# EAGLE schematic LiPo_Battery_Charger (EAGLE 9.6.2)
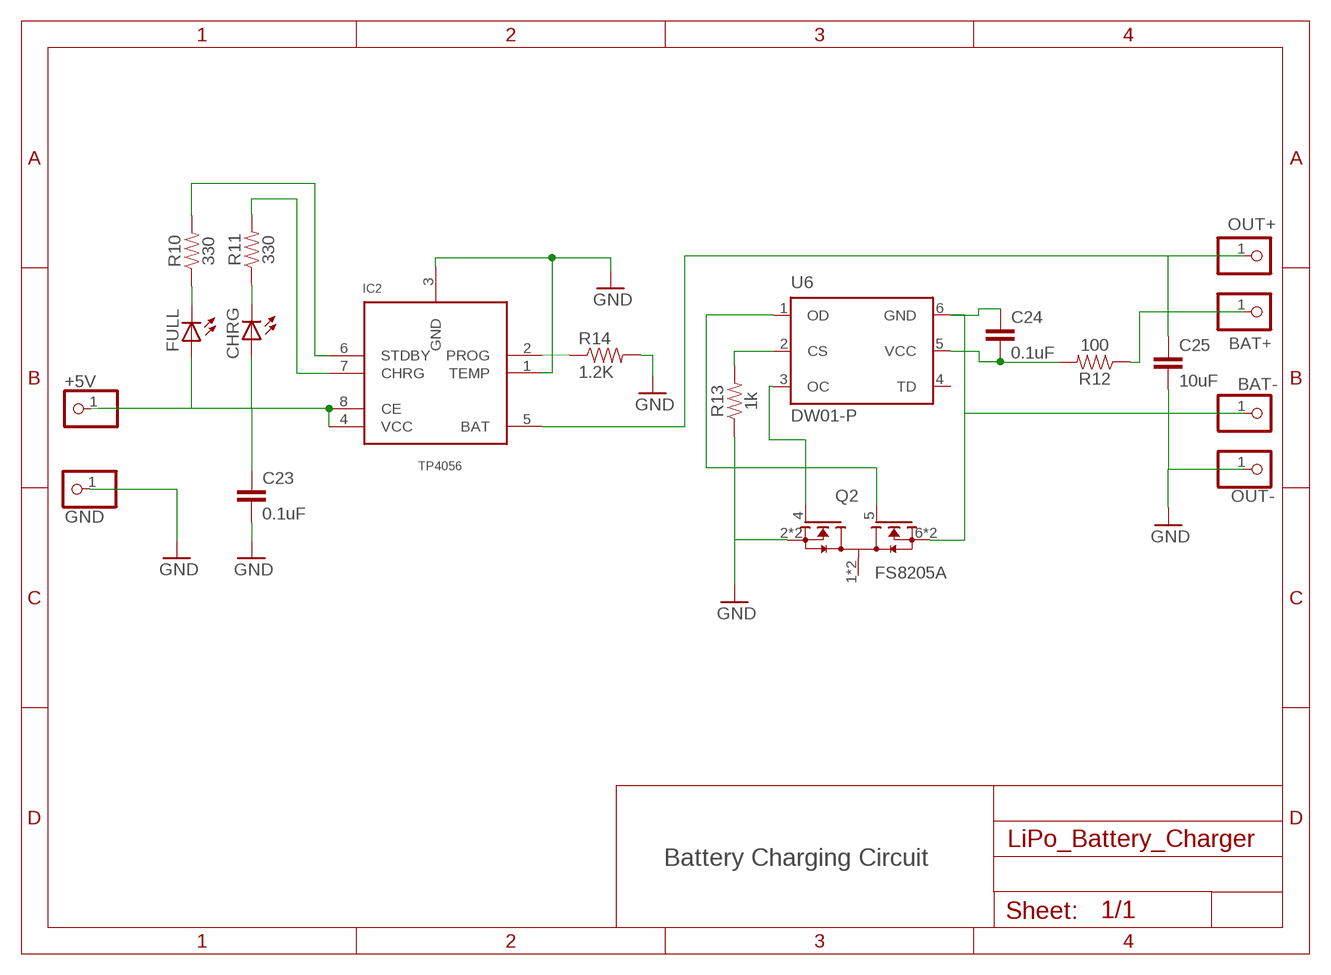
[diagram p0: schematic, sheet 1]

## Parts
+5V  PINHD-1X1  [1X01]
BAT+  PINHD-1X1  [1X01]
BAT-  PINHD-1X1  [1X01]
C23  0.1uF  10UF-1206-6.3V-20%  [1206]
C24  0.1uF  10UF-1206-6.3V-20%  [1206]
C25  10uF  10UF-1206-6.3V-20%  [1206]
CHRG  green  LEDCHIP-LED0805  [CHIP-LED0805]
FULL  red  LEDCHIP-LED0805  [CHIP-LED0805]
GND  PINHD-1X1  [1X01]
IC2  TP4056  [SOP-8]
OUT+  PINHD-1X1  [1X01]
OUT-  PINHD-1X1  [1X01]
Q2  FS8205A  [SOP65P640X120-8N]
R10  330  330OHM-0603-1/10W-1%  [0603]
R11  330  330OHM-0603-1/10W-1%  [0603]
R12  100  1KOHM-0603-1/10W-1%  [0603]
R13  1k  1KOHM-0603-1/10W-1%  [0603]
R14  1.2K  RESISTOR0603-RES  [0603-RES]
U6  DW01-P  [SOT23-6L]

## Nets
+5V: +5V.1 C23.1 CHRG.A FULL.A IC2.4(VCC) IC2.8(CE)
BAT-: BAT-.1 C24.1 Q2.6(S2) Q2.7(S2) U6.6(GND)
GND: C23.2 GND.1 IC2.1(TEMP) IC2.3(GND) Q2.2(S1) Q2.3(S1) R13.1 R14.2
N$4: Q2.5(G2) U6.1(OD)
N$7: R13.2 U6.2(CS)
N$9: IC2.2(PROG) R14.1
N$10: C24.2 R12.2 U6.5(VCC)
N$12: FULL.C R10.1
N$21: CHRG.C R11.1
N$22: IC2.6(STDBY) R10.2
N$36: IC2.7(CHRG) R11.2
N$51: Q2.4(G1) U6.3(OC)
OUT+: BAT+.1 C25.1 IC2.5(BAT) OUT+.1 R12.1
OUT-: C25.2 OUT-.1 ; supply symbol labelled GND
Unconnected: Q2.1(D12) Q2.8(D12) U6.4(TD)

## Notes on the sheet
- BAT+
- Battery Charging Circuit

## Library data of the parts
+5V BAT+ BAT- GND OUT+ OUT- = adafruit:PINHD-1X1: Pin header 1x1 for 0.1" spacing With round pins
C23 C24 = SparkFun-Capacitors:10UF: 10.0µF ceramic capacitors A capacitor is a passive two-terminal electrical component used to store electrical energy temporarily in an electric field.; PROD_ID: CAP-10057; VALUE: 10uF
C25 = SparkFun-Capacitors:10UF: 10.0µF ceramic capacitors A capacitor is a passive two-terminal electrical component used to store electrical energy temporarily in an electric field.; PROD_ID: CAP-10057
CHRG FULL = adafruit:LED: LED OSRAM: - CHIPLED LG R971, LG N971, LY N971, LG Q971, LY Q971, LO R971, LY R971 LH N974, LH R974 LS Q976, LO Q976, LY Q976 LO Q996 - Hyper CHIPLED LW Q18S LB Q993, LB Q99A, LB R99A - SideLED LS A670, LO A670, LY A670, LG A670, LP A670 LB A673, LV A673, LT A673, LW A673 LH A674 LY A675 LS A676, LA A676, LO A676, LY A676, LW A676 LS A679, LY A679, LG A679 - Hyper Micro SIDELED® LS Y876, LA Y876, LO Y876, LY Y876 LT Y87S - SmartLED LW L88C, LW L88S LB L89C, LB L89S, LG L890 LS L89K, LO L89K, LY L89K LS L896, LA L896, LO L896, LY L896 - TOPLED LS T670, LO T670, LY T670, LG T670, LP T670 LSG T670, LSP T670, LSY T670, LOP T670, LYG T670 LG T671, LOG T671, LSG T671 LB T673, LV T673, LT T673, LW T673 LH T674 LS T676, LA T676, LO T676, LY T676, LB T676, LH T676, LSB T676, LW T676 LB T67C, LV T67C, LT T67C, LS T67K, LO T67K, LY T67K, LW E67C LS E67B, LA E67B, LO E67B, LY E67B, LB E67C, LV E67C, LT E67C LW T67C LS T679, LY T679, LG T679 LS T770, LO T770, LY T770, LG T770, LP T770 LB T773, LV T773, LT T773, LW T773 LH T774 LS E675, LA E675, LY E675, LS T675 LS T776, LA T776, LO T776, LY T776, LB T776 LHGB T686 LT T68C, LB T68C - Hyper Mini TOPLED® LB M676 - Mini TOPLED Santana® LG M470 LS M47K, LO M47K, LY M47K Source: http://www.osram.convergy.de/
IC2 = TP4056:TP4056; AVAILABILITY: Unavailable; DESCRIPTION: Complete single cell Li-Ion battery with a constant current / constant voltage linear charger; MF: NanJing Top Power ASIC Corp.; MP: TP4056; PACKAGE: Package; PRICE: None
Q2 = FS8205A:FS8205A: N/A; AVAILABILITY: Unavailable; MF: Fortune Semiconductor; MP: FS8205A; PACKAGE: Package; PRICE: None
R10 R11 = SparkFun-Resistors:330OHM: 330Ω resistor A resistor is a passive two-terminal electrical component that implements electrical resistance as a circuit element. Resistors act to reduce current flow, and, at the same time, act to lower voltage levels within circuits. - Wikipedia; PROD_ID: RES-00818
R12 = SparkFun-Resistors:1KOHM: 1kΩ resistor A resistor is a passive two-terminal electrical component that implements electrical resistance as a circuit element. Resistors act to reduce current flow, and, at the same time, act to lower voltage levels within circuits. - Wikipedia; PROD_ID: RES-07856; VALUE: 1k
R13 = SparkFun-Resistors:1KOHM: 1kΩ resistor A resistor is a passive two-terminal electrical component that implements electrical resistance as a circuit element. Resistors act to reduce current flow, and, at the same time, act to lower voltage levels within circuits. - Wikipedia; PROD_ID: RES-07856
R14 = SparkFun:RESISTOR: Resistor Basic schematic elements and footprints for 0603, 1206, and PTH resistors.
U6 = lipo:DW01-P: One Cell Lithium-ion/Polymer Battery Protection IC The DW01-P battery protection IC is designed to protect lithium-ion/polymer battery from damage or degrading the lifetime due to overcharge, overdischarge, and/or overcurrent for one-cell lithium-ion/polymer battery powered systems, such as cellular phones. The ultra-small package and less required external components make it ideal to integrate the DW01-P into the limited space of battery pack. The accurate ±50mV overcharging detection voltage ensures safe and full utilization charging. The very low standby current drains little current from the cell while in storage.